# EAGLE design RGB_i2c_v2plusRTC (EAGLE 7.1.0)
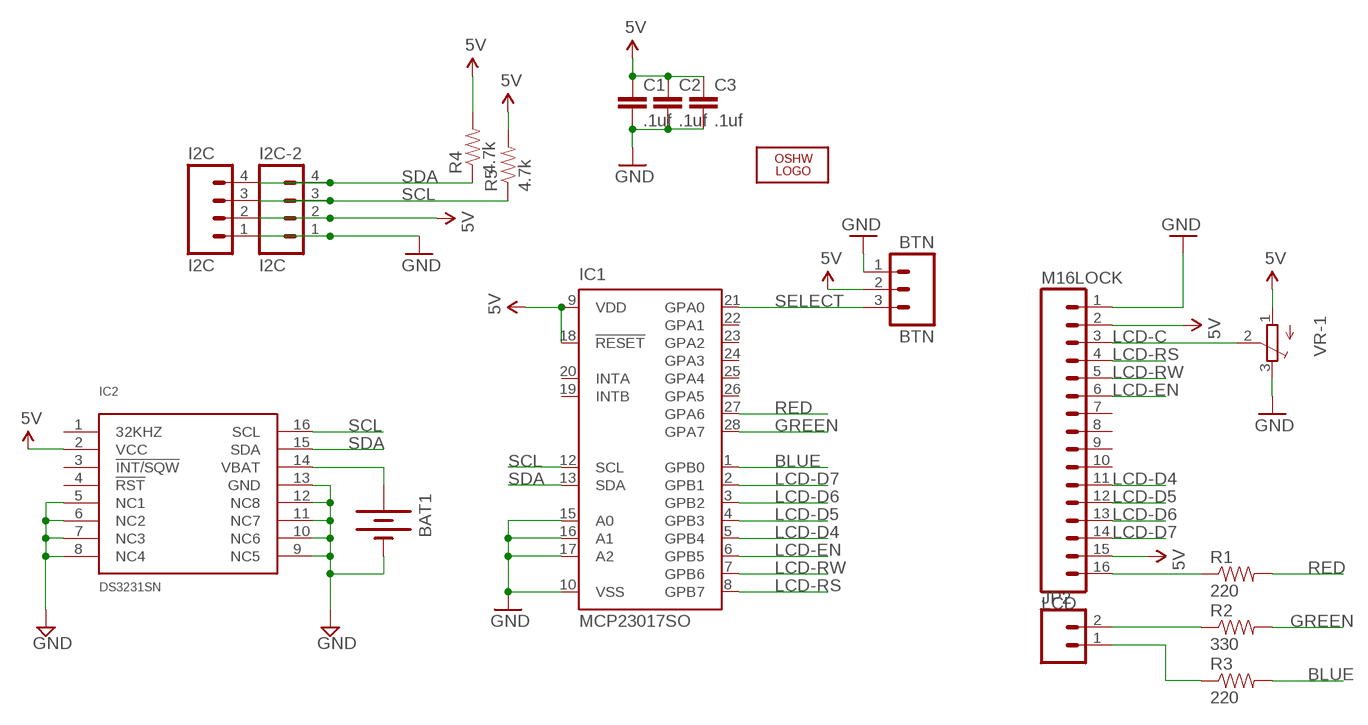
[diagram p0: schematic, sheet 1]

## Parts
BAT1  BATTERY12MM  [BATTCON_12MM]
BTN  BTN  M03LOCK  [1X03_LOCK]
C1  .1uf  CAP0805  [0805]
C2  .1uf  CAP0805  [0805]
C3  .1uf  CAP0805  [0805]
I2C  I2C  M04LOCK  [1X04_LOCK]
I2C-2  I2C  M04LOCK  [1X04_LOCK]
IC1  MCP23017SO  [SO28W]
IC2  DS3231SN  [SO16W]
JP2  M02PTH  [1X02]
LCD  M16LOCK  [1X16_LOCK]
LOGO2  OSHW_LOGO_10MILX0350-NT  [OSHW_10X350_NOTEXT]
R1  220  RESISTOR0805-RES  [0805]
R2  330  RESISTOR0805-RES  [0805]
R3  220  RESISTOR0805-RES  [0805]
R4  4.7k  RESISTOR0805-RES  [0805]
R5  4.7k  RESISTOR0805-RES  [0805]
VR-1  TRIMPOTTC33X  [TC33X]

## Nets
5V: BTN.2 C1.1 C2.1 C3.1 I2C-2.2 I2C.2 IC1.9(VDD) IC1.18(!RESET) IC2.2(VCC) LCD.2 LCD.15 R4.2 R5.2 VR-1.1(A)
BLUE: IC1.1(GPB0) R3.2
GND: BAT1.GND(-) BTN.1 C1.2 C2.2 C3.2 I2C-2.1 I2C.1 IC1.10(VSS) IC1.15(A0) IC1.16(A1) IC1.17(A2) IC2.5(NC1) IC2.6(NC2) IC2.7(NC3) IC2.8(NC4) IC2.9(NC5) IC2.10(NC6) IC2.11(NC7) IC2.12(NC8) IC2.13(GND) LCD.1 VR-1.3(E)
GREEN: IC1.28(GPA7) R2.2
LCD-C: LCD.3 VR-1.2(S)
LCD-D4: IC1.5(GPB4) LCD.11
LCD-D5: IC1.4(GPB3) LCD.12
LCD-D6: IC1.3(GPB2) LCD.13
LCD-D7: IC1.2(GPB1) LCD.14
LCD-EN: IC1.6(GPB5) LCD.6
LCD-RS: IC1.8(GPB7) LCD.4
LCD-RW: IC1.7(GPB6) LCD.5
N$1: JP2.2 R2.1
N$2: JP2.1 R3.1
N$3: BAT1.PWR@1(+) IC2.14(VBAT)
N$4: LCD.16 R1.1
RED: IC1.27(GPA6) R1.2
SCL: I2C-2.3 I2C.3 IC1.12(SCL) IC2.16(SCL) R5.1
SDA: I2C-2.4 I2C.4 IC1.13(SDA) IC2.15(SDA) R4.1
SELECT: BTN.3 IC1.21(GPA0)
Unconnected: IC1.19(INTB) IC1.20(INTA) IC1.22(GPA1) IC1.23(GPA2) IC1.24(GPA3) IC1.25(GPA4) IC1.26(GPA5) IC2.1(32KHZ) IC2.3(!INT/SQW) IC2.4(!RST) LCD.7 LCD.8 LCD.9 LCD.10

## Library data of the parts
BAT1 = SparkFun:BATTERY: Battery Holders Various common sizes : AA, AAA, 20mm coin cell and 12mm coin cell.
BTN = SparkFun:M03: Header 3 Standard 3-pin 0.1" header. Use with straight break away headers (SKU : PRT-00116), right angle break away headers (PRT-00553), swiss pins (PRT-00743), machine pins (PRT-00117), and female headers (PRT-00115). Molex polarized connector foot print use with SKU : PRT-08232 with associated crimp pins and housings.
C1-C3 = SparkFun:CAP: Capacitor Standard 0603 ceramic capacitor, and 0.1" leaded capacitor.
I2C I2C-2 = SparkFun:M04: Header 4 Standard 4-pin 0.1" header. Use with straight break away headers (SKU : PRT-00116), right angle break away headers (PRT-00553), swiss pins (PRT-00743), machine pins (PRT-00117), and female headers (PRT-00115). Molex polarized connector foot print use with SKU : PRT-08231 with associated crimp pins and housings. 1MM SMD Version SKU: PRT-10208
IC1 = adafruit:MCP23017: http://ww1.microchip.com/downloads/en/DeviceDoc/21952a.pdf Source: http://ww1.microchip.com/downloads/en/DeviceDoc/21952a.pdf
IC2 = comfile:DS3231SN
JP2 = SparkFun:M02: Header 2 Standard 2-pin 0.1" header. Use with straight break away headers (SKU : PRT-00116), right angle break away headers (PRT-00553), swiss pins (PRT-00743), machine pins (PRT-00117), and female headers (PRT-00115). Molex polarized connector foot print use with SKU : PRT-08233 with associated crimp pins and housings.
LCD = SparkFun:M16
LOGO2 = ohw-logo:OSHW_LOGO_10MIL
R1-R5 = SparkFun:RESISTOR: Resistor Basic schematic elements and footprints for 0603, 1206, and PTH resistors.
VR-1 = adafruit:TRIMPOT: SMT trimmer potentiometer part number TC33X http://www.ladyada.net/library/eagle

## Board
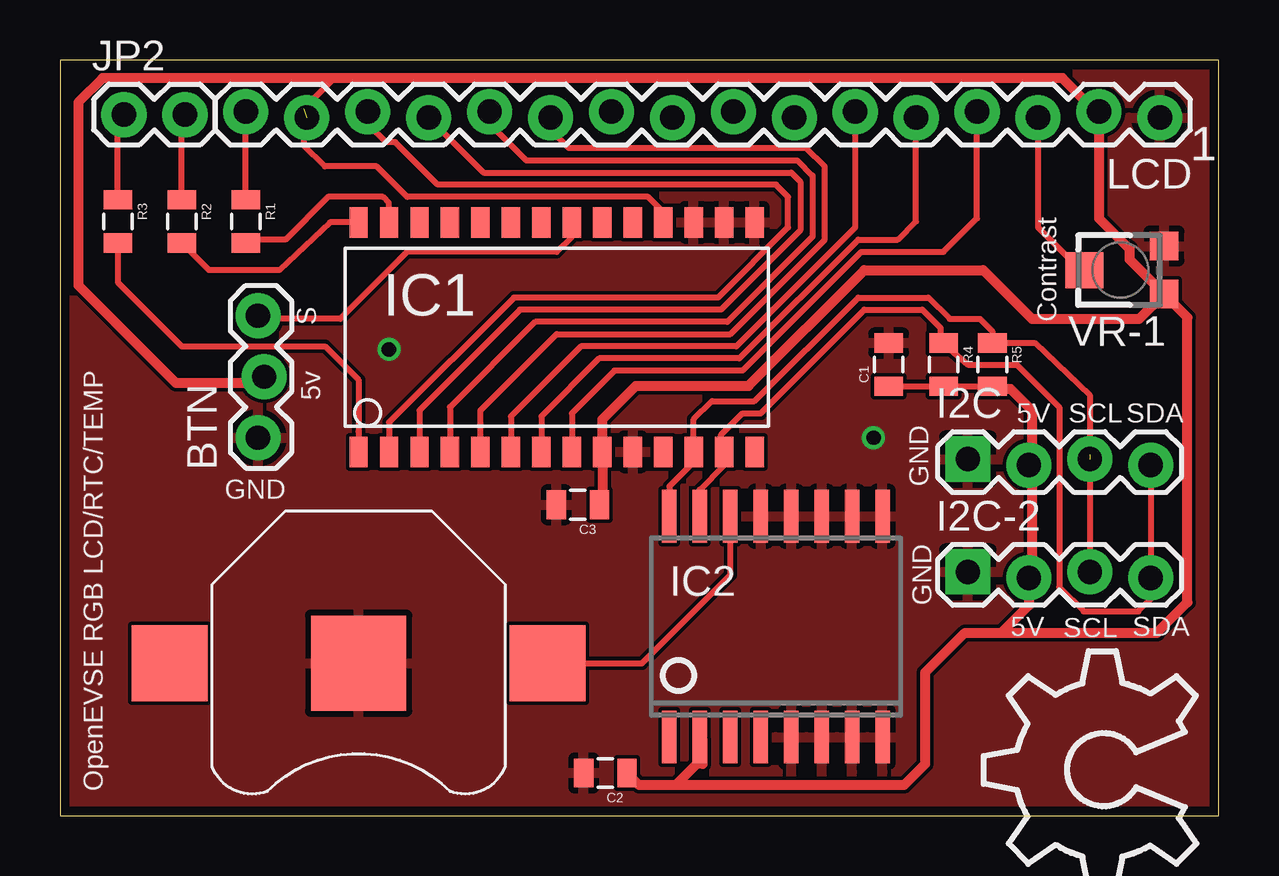
[diagram p1: board, top side]
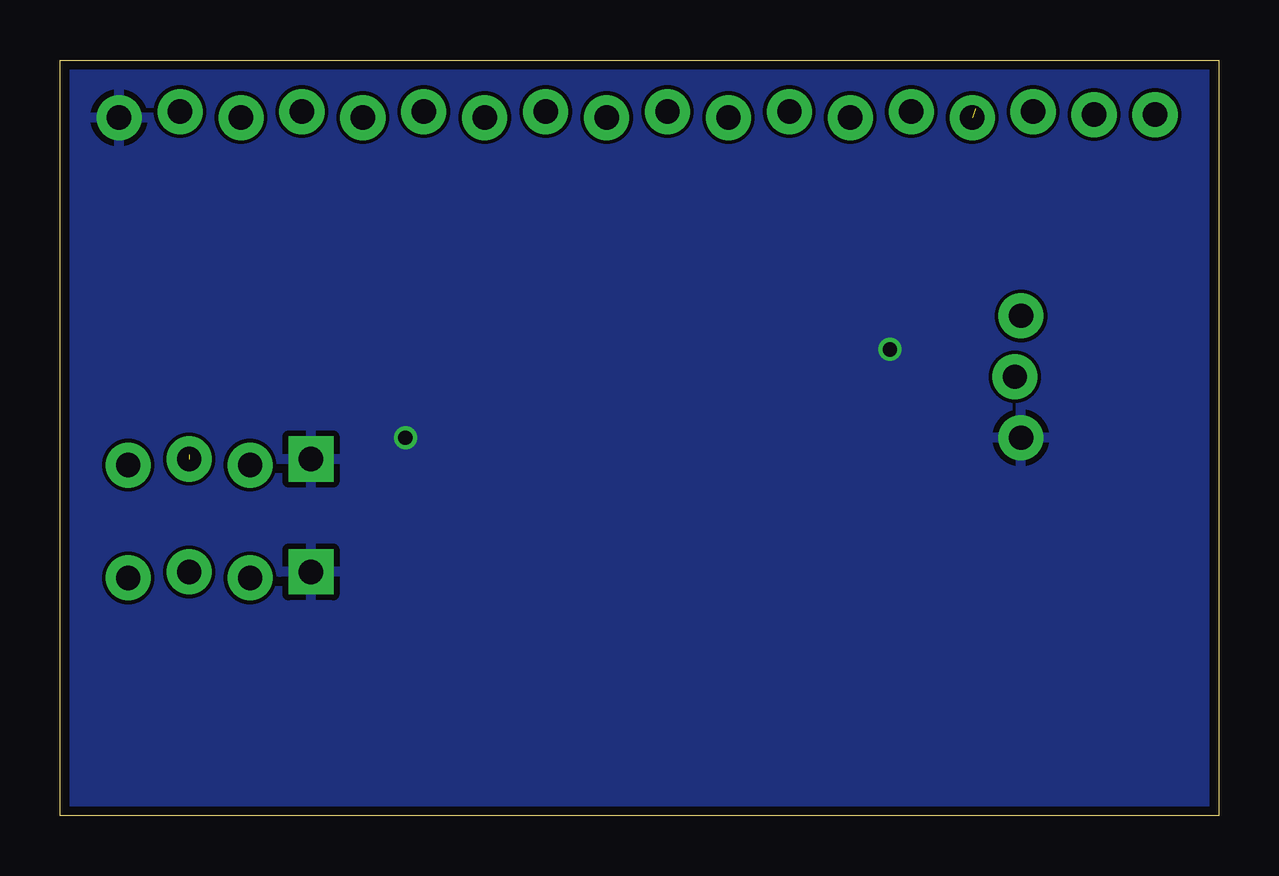
[diagram p2: board, bottom side, seen from below]

Size 48.31 x 31.49 mm. Coordinates in mm from the lower left corner, seen from the top.
Outline: 0,0 48.31,0 48.31,31.49 0,31.49 0,0
Copper layers (1*16): Top 0.0356mm / dielectric 1.5011mm / Bottom 0.0356mm
Design rules "default": minimum track width 6mil, minimum drill 13mil, track to track 6mil, track to pad 6mil, pad to pad 6mil, via to via 6mil, smd to smd 6mil, copper to edge 15mil, drill to drill 6mil, minimum pad ring 7mil, minimum via ring 7mil, stop-mask expansion 4mil, vias tented up to drill 0mil, thermal gap 10mil

### Footprints (pad centres in the part's own frame; a part is rotated, then mirrored left to right if it is on the bottom)
BATTCON_12MM = smd 3.962 x 3.962: GND 0,0 | smd 3.175 x 3.175: PWR@1 -7.874,0; PWR@2 7.874,0
1X03_LOCK = drill 1.016 pad 1.88: 1 0,0.127; 2 2.54,-0.127; 3 5.08,0.127
0805 = smd 0.8 x 1.2: 1 -0.9,0; 2 0.9,0
1X04_LOCK = drill 1.016 pad 1.88 square: 1 0,0.127 | drill 1.016 pad 1.88: 2 2.54,-0.127; 3 5.08,0.127; 4 7.62,-0.127
SO28W = smd 0.762 x 1.27: 1 -7.62,-4.78; 2 -6.35,-4.78; 3 -5.08,-4.78; 4 -3.81,-4.78; 5 -2.54,-4.78; 6 -1.27,-4.78; 7 0,-4.78; 8 1.27,-4.78; 9 2.54,-4.78; 10 3.81,-4.78; 11 5.08,-4.78; 12 6.35,-4.78; 13 7.62,-4.78; 14 8.89,-4.78; 15 8.89,4.78; 16 7.62,4.78; 17 6.35,4.78; 18 5.08,4.78; 19 3.81,4.78; 20 2.54,4.78; 21 1.27,4.78; 22 0,4.78; 23 -1.27,4.78; 24 -2.54,4.78; 25 -3.81,4.78; 26 -5.08,4.78; 27 -6.35,4.78; 28 -7.62,4.78
SO16W = smd 0.6 x 2.2: 1 -4.445,-4.6; 2 -3.175,-4.6; 3 -1.905,-4.6; 4 -0.635,-4.6; 5 0.635,-4.6; 6 1.905,-4.6; 7 3.175,-4.6; 8 4.445,-4.6; 9 4.445,4.6; 10 3.175,4.6; 11 1.905,4.6; 12 0.635,4.6; 13 -0.635,4.6; 14 -1.905,4.6; 15 -3.175,4.6; 16 -4.445,4.6
1X02 = drill 1.016 pad 1.88: 1 0,0; 2 2.54,0
1X16_LOCK = drill 1.016 pad 1.88: 1 0,0.127; 2 2.54,-0.127; 3 5.08,0.127; 4 7.62,-0.127; 5 10.16,0.127; 6 12.7,-0.127; 7 15.24,0.127; 8 17.78,-0.127; 9 20.32,0.127; 10 22.86,-0.127; 11 25.4,0.127; 12 27.94,-0.127; 13 30.48,0.127; 14 33.02,-0.127; 15 35.56,0.127; 16 38.1,-0.127
TC33X = smd 1.2 x 1.2: 1 -1,-1.825; 3 1,-1.825 | smd 1.5 x 1.6: 2 0,1.5

### Placement (x,y rotation side)
BAT1  12.45,6.35 180 top
BTN  8.38,15.75 90 top
C1  34.54,18.8 90 top
C2  22.73,1.78 180 top
C3  21.59,12.95 180 top
I2C  37.85,14.73 0 top
I2C-2  37.85,10.03 0 top
IC1  20.07,19.94 0 top
IC2  29.85,7.87 0 top
JP2  2.67,29.21 0 top
LCD  45.85,29.21 180 top
LOGO2  47.37,-3.05 90 top  (outside the outline)
R1  7.75,24.77 270 top
R2  5.08,24.77 270 top
R3  2.41,24.77 270 top
R4  36.83,18.8 270 top
R5  38.86,18.8 270 top
VR-1  44.2,22.73 90 top

### Tracks (layer width: path | path; a pad name or v marks a point on that pad's centre or on a via)
5V  (1 unrouted)
  Top 0.254: 34.81,17.78 C1.1 R4.2 R5.2 38.98,17.78 39.5,17.78 | C2.1 23.63,1.89 | 22.61,12.83 22.61,13.21 C3.1 | IC1.18 25.15,25.15 24.51,25.78 14.48,25.78 13.21,27.05 11.05,27.05 10.16,27.94 10.16,29.46 11.43,30.73
  Top 0.406: C3.1 22.61,13.07 IC1.9 22.61,16.51 24,17.91 28.7,17.91 33.53,22.73 38.48,22.73 40.51,20.7 44.99,20.7 VR-1.1 | IC2.2 26.8,3.15 26.8,2.16 26.54,2.16 25.65,1.27 | VR-1.1 46.99,20.76 46.99,8.89 45.72,7.62 39.24,7.62 | 25.65,1.27 35.18,1.27 36.07,2.16 36.07,5.97 37.72,7.62 39.24,7.62 | 25.65,1.27 24.14,1.27 C2.1 | VR-1.1 44.58,23.18 44.58,23.62 43.31,24.89 LCD.2 43.18,29.34 41.78,30.73 11.43,30.73 1.78,30.73 0.76,29.72 0.76,22.1 4.83,18.03 8.38,18.03 BTN.2 | 39.24,7.62 40.39,8.76 I2C-2.2 40.51,10.03 40.51,14.86 | 39.5,17.78 39.62,17.78 40.51,16.89 40.51,14.86 | I2C.2 40.39,14.73 40.51,14.86
BLUE
  Top 0.254: R3.2 2.41,22.23 5.08,19.56 11.05,19.56 12.45,18.16 IC1.1 12.45,16
GND  (via drill 0.6)
  other vias: 33.91,15.75 13.72,19.43
  pour Top: -4.7,-4.32 52.32,-4.06 52.07,35.18 -4.83,34.8
  pour Bottom: -3.43,-2.16 50.42,-2.16 50.55,33.53 -2.92,33.27
GREEN
  Top 0.254: IC1.28 11.26,24.72 9.14,22.73 6.21,22.73 R2.2
LCD-C
  Top 0.254: LCD.3 40.77,24.51 42.67,22.61 42.67,22.76 VR-1.2
LCD-D4
  Top 0.254: IC1.5 17.53,16.89 20.7,20.07 27.94,20.07 31.88,24 31.88,27.05 31.11,27.81 21.21,27.81 20.45,28.58 LCD.11
LCD-D5
  Top 0.254: LCD.12 17.91,28.83 19.43,27.3 30.73,27.3 31.37,26.67 31.37,24.13 27.81,20.57 19.81,20.57 16.26,17.02 IC1.4
LCD-D6
  Top 0.254: LCD.13 17.65,26.8 30.48,26.8 30.86,26.42 30.86,24.38 27.56,21.08 19.18,21.08 14.99,16.89 IC1.3
LCD-D7
  Top 0.254: LCD.14 13.08,29.08 13.08,28.58 13.59,28.07 13.97,28.07 15.75,26.29 29.85,26.29 30.35,25.78 30.35,24.51 27.43,21.59 18.92,21.59 13.72,16.38 IC1.2
LCD-EN
  Top 0.254: LCD.6 33.15,25.15 33.15,24.64 33.15,24.51 28.19,19.56 21.72,19.56 18.8,16.64 IC1.6
LCD-RS
  Top 0.254: LCD.4 38.23,24.89 36.83,23.49 33.4,23.49 28.45,18.54 23.11,18.54 21.34,16.76 IC1.8
LCD-RW
  Top 0.254: LCD.5 35.69,24.77 34.92,24 33.27,24 28.32,19.05 22.48,19.05 20.07,16.64 IC1.7
N$1
  Top 0.254: R2.1 5.08,29.08 JP2.2
N$2
  Top 0.254: R3.1 2.41,28.96 JP2.1
N$3
  Top 0.254: BAT1.PWR@1 24.26,6.35 27.94,10.03 IC2.14
N$4
  Top 0.254: R1.1 LCD.16
RED
  Top 0.254: 7.36,23.87 R1.2 7.89,24 9.4,24 11.18,25.78 13.46,25.78 13.72,25.53 IC1.27
SCL  (1 unrouted)
  Top 0.254: 42.93,15.03 42.93,17.53 40.63,19.7 R5.1 38.86,20.19 38.35,20.7 37.08,20.7 36.19,21.59 33.27,21.59 28.96,17.27 27.18,17.27 26.42,16.51 IC1.12 26.42,14.73 25.4,13.72 IC2.16 | I2C.3 I2C-2.3
SDA
  Top 0.254: IC2.15 26.67,13.59 27.69,14.6 IC1.13 27.56,15.54 27.56,15.88 28.45,16.76 29.21,16.76 33.53,21.08 35.94,21.08 36.7,20.32 36.7,19.82 R4.1 36.96,19.7 36.96,19.56 37.85,18.8 39.88,18.8 41.66,17.02 41.66,9.53 42.67,8.51 44.96,8.51 45.72,9.27 45.72,9.78 I2C-2.4 I2C.4
SELECT
  Top 0.254: IC1.21 21.34,24.13 20.7,23.49 14.48,23.49 11.68,20.7 8.43,20.7
  Top 0.406: 8.43,20.7 BTN.3

### Text on the board
tNames: 1 | S | Contrast | 5v | 5V | SCL | SDA | GND | GND | GND | SCL | 5V | SDA | OpenEVSE RGB LCD/RTC/TEMP